# EAGLE design debug01 (EAGLE 6.4)
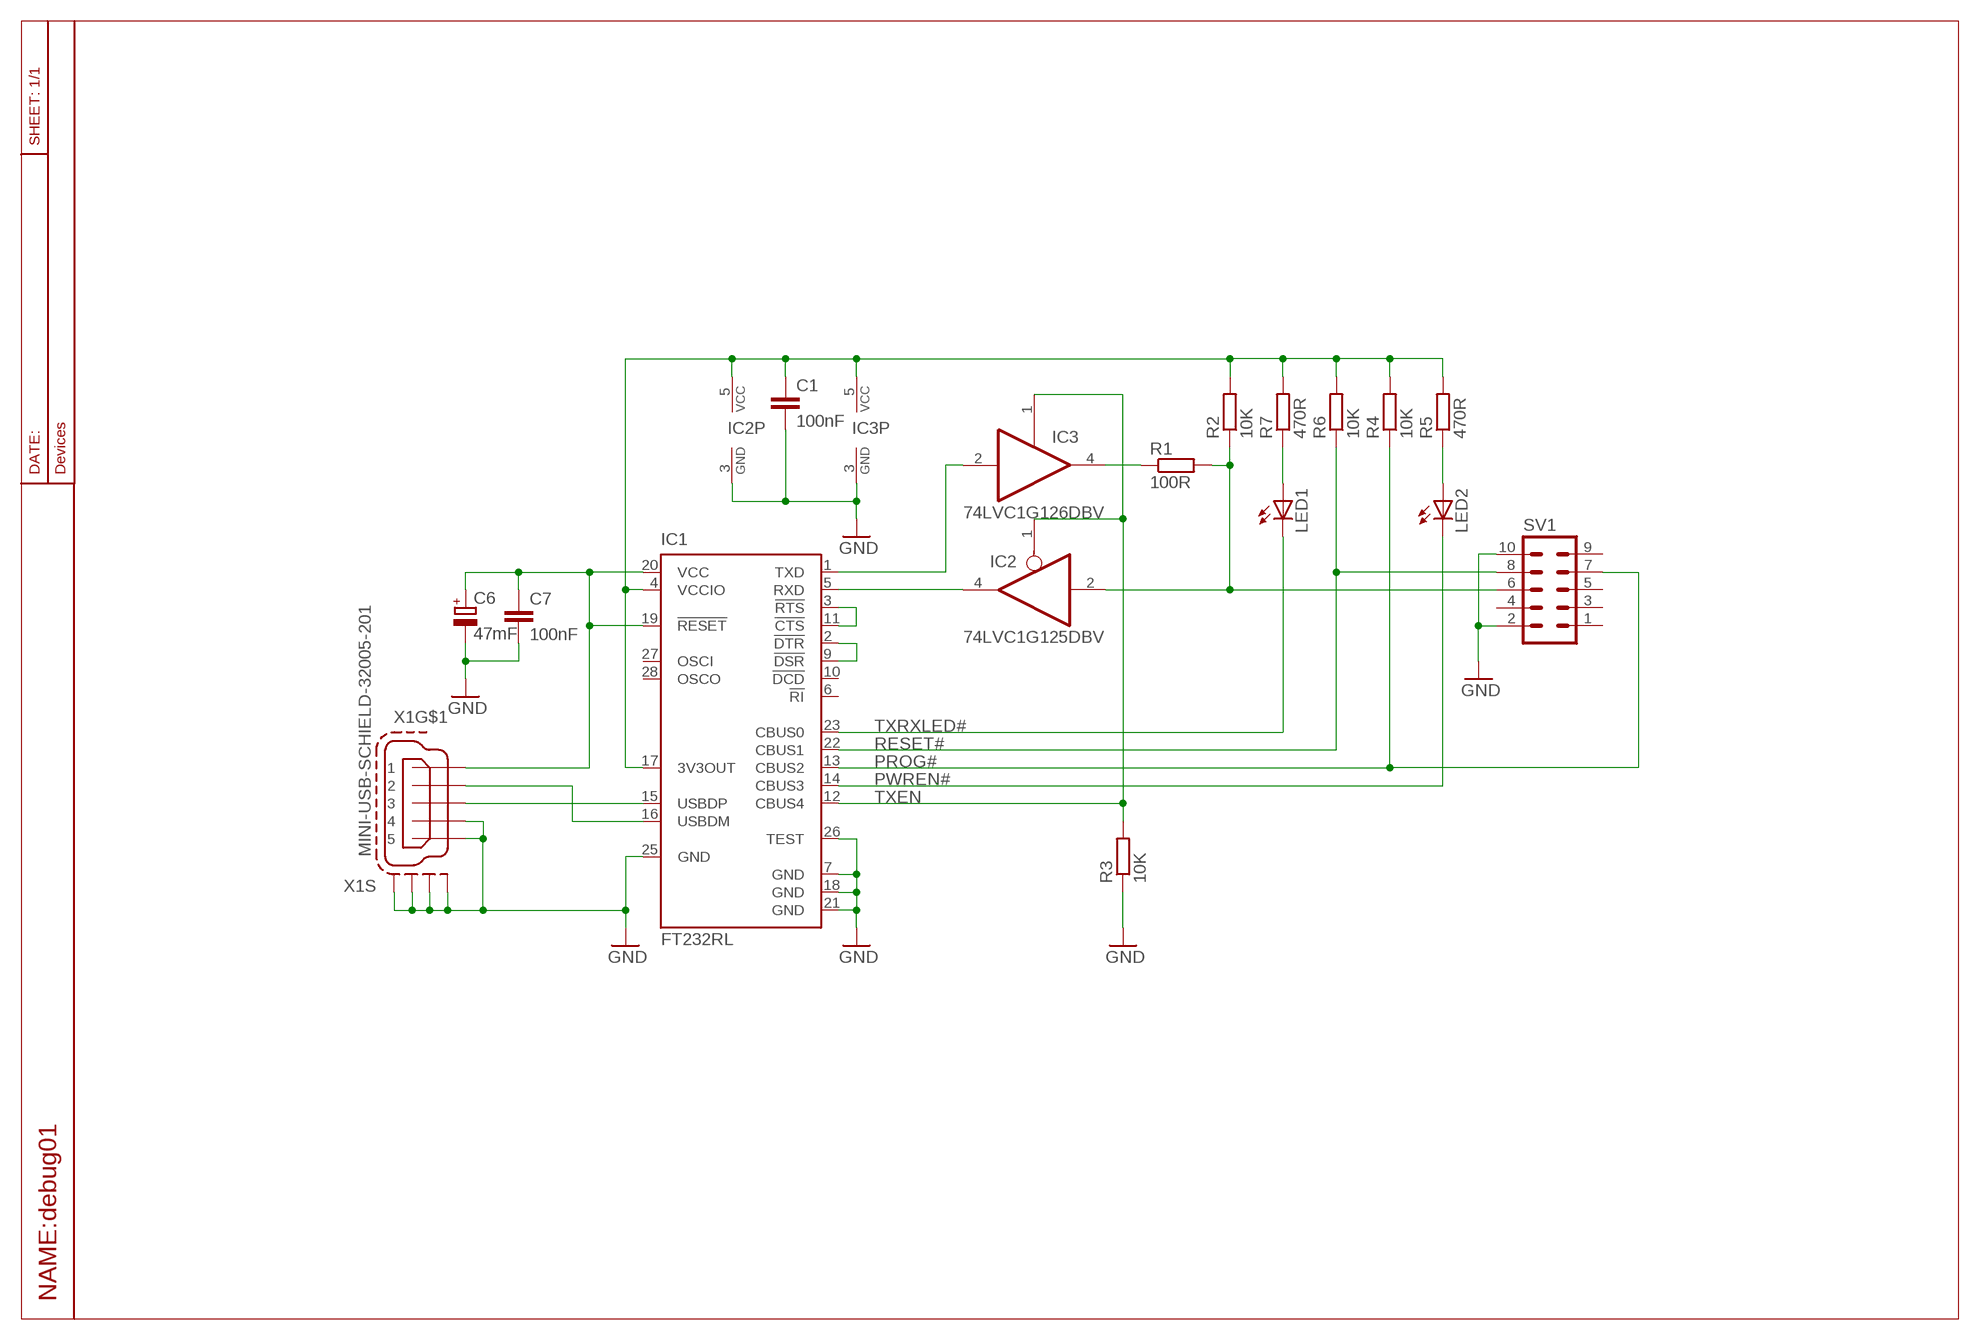
[diagram p0: schematic, sheet 1]

## Parts
C1  100nF  C-EUC0603  [C0603]
C6  47mF  CPOL-EUCT3528  [CT3528]
C7  100nF  C-EUC0603  [C0603]
IC1  FT232RL  [SSOP28]
IC2  74LVC1G125DBV  [SOT23-5]
IC3  74LVC1G126DBV  [SOT23-5]
LED1  LEDCHIPLED_0805  [CHIPLED_0805]
LED2  LEDCHIPLED_0805  [CHIPLED_0805]
R1  100R  R-EU_R0603  [R0603]
R2  10K  R-EU_R0603  [R0603]
R3  10K  R-EU_R1206  [R1206]
R4  10K  R-EU_R0603  [R0603]
R5  470R  R-EU_R0603  [R0603]
R6  10K  R-EU_R0603  [R0603]
R7  470R  R-EU_R0603  [R0603]
SV1  ML10  [ML10]
X1  MINI-USB-SCHIELD-32005-201  [32005-201]

## Nets
+3V3: C1.1 IC1.4(VCCIO) IC1.17(3V3OUT) IC2.5(VCC) IC3.5(VCC) R2.2 R4.2 R5.2 R6.2 R7.2
+5V0: C6.+ C7.1 IC1.19(!RESET) IC1.20(VCC) X1.1
DBG: IC2.2(I) R1.2 R2.1 SV1.6
DM: IC1.16(USBDM) X1.2
DP: IC1.15(USBDP) X1.3
GND: C1.2 C6.- C7.2 IC1.7(GND) IC1.18(GND) IC1.21(GND) IC1.25(GND) IC1.26(TEST) IC2.3(GND) IC3.3(GND) R3.1 SV1.2 SV1.10 X1.4 X1.5 X1.M1(S:S1) X1.M2(S:S2) X1.M3(S:S3) X1.M4(S:S4)
N$2: LED2.A R5.1
N$5: IC3.4(O) R1.1
N$7: LED1.A R7.1
N$10: IC1.2(!DTR) IC1.9(!DSR)
N$11: IC1.3(!RTS) IC1.11(!CTS)
PROG#: IC1.13(CBUS2) R4.1 SV1.7
PWREN#: IC1.14(CBUS3) LED2.C
RESET#: IC1.22(CBUS1) R6.1 SV1.8
RXD: IC1.5(RXD) IC2.4(O)
TXD: IC1.1(TXD) IC3.2(I)
TXEN: IC1.12(CBUS4) IC2.1(OE) IC3.1(OE) R3.2
TXRXLED#: IC1.23(CBUS0) LED1.C
Unconnected: IC1.6(!RI) IC1.10(!DCD) IC1.27(OSCI) IC1.28(OSCO) SV1.1 SV1.3 SV1.4 SV1.5 SV1.9

## Library data of the parts
C1 C7 = rcl:C-EU: CAPACITOR, European symbol
C6 = rcl:CPOL-EU: POLARIZED CAPACITOR, European symbol
IC1 = ftdichip:FT232R: Source: http://www.ftdichip.com/Documents/DataSheets/DS_FT232R_v104.pdf; MPN: FT232RL; OC_FARNELL: 1146032; OC_NEWARK: 91K9918
IC2 = 74xx-little-us:74*1G125: Single Bus Buffer Gate with 3-State Output
IC3 = 74xx-little-us:74*1G126: Single Bus Buffer Gate With 3-State Outputs
LED1 LED2 = led:LED: LED OSRAM: - CHIPLED LG R971, LG N971, LY N971, LG Q971, LY Q971, LO R971, LY R971 LH N974, LH R974 LS Q976, LO Q976, LY Q976 LO Q996 - Hyper CHIPLED LW Q18S LB Q993, LB Q99A, LB R99A - SideLED LS A670, LO A670, LY A670, LG A670, LP A670 LB A673, LV A673, LT A673, LW A673 LH A674 LY A675 LS A676, LA A676, LO A676, LY A676, LW A676 LS A679, LY A679, LG A679 - Hyper Micro SIDELED® LS Y876, LA Y876, LO Y876, LY Y876 LT Y87S - SmartLED LW L88C, LW L88S LB L89C, LB L89S, LG L890 LS L89K, LO L89K, LY L89K LS L896, LA L896, LO L896, LY L896 - TOPLED LS T670, LO T670, LY T670, LG T670, LP T670 LSG T670, LSP T670, LSY T670, LOP T670, LYG T670 LG T671, LOG T671, LSG T671 LB T673, LV T673, LT T673, LW T673 LH T674 LS T676, LA T676, LO T676, LY T676, LB T676, LH T676, LSB T676, LW T676 LB T67C, LV T67C, LT T67C, LS T67K, LO T67K, LY T67K, LW E67C LS E67B, LA E67B, LO E67B, LY E67B, LB E67C, LV E67C, LT E67C LW T67C LS T679, LY T679, LG T679 LS T770, LO T770, LY T770, LG T770, LP T770 LB T773, LV T773, LT T773, LW T773 LH T774 LS E675, LA E675, LY E675, LS T675 LS T776, LA T776, LO T776, LY T776, LB T776 LHGB T686 LT T68C, LB T68C - Hyper Mini TOPLED® LB M676 - Mini TOPLED Santana® LG M470 LS M47K, LO M47K, LY M47K Source: http://www.osram.convergy.de LUXEON: - LUMILED® LXK2-PW12-R00, LXK2-PW12-S00, LXK2-PW14-U00, LXK2-PW14-V00 LXK2-PM12-R00, LXK2-PM12-S00, LXK2-PM14-U00 LXK2-PE12-Q00, LXK2-PE12-R00, LXK2-PE12-S00, LXK2-PE14-T00, LXK2-PE14-U00 LXK2-PB12-K00, LXK2-PB12-L00, LXK2-PB12-M00, LXK2-PB14-N00, LXK2-PB14-P00, LXK2-PB14-Q00 LXK2-PR12-L00, LXK2-PR12-M00, LXK2-PR14-Q00, LXK2-PR14-R00 LXK2-PD12-Q00, LXK2-PD12-R00, LXK2-PD12-S00 LXK2-PH12-R00, LXK2-PH12-S00 LXK2-PL12-P00, LXK2-PL12-Q00, LXK2-PL12-R00 Source: www.luxeon.com KINGBRIGHT: KA-3528ASYC Source: www.kingbright.com
R1-R7 = rcl:R-EU_: RESISTOR, European symbol
SV1 = con-ml:ML10: HARTING; OC_FARNELL: unknown; OC_NEWARK: unknown
X1 = con-cypressindustries:MINI-USB-SCHIELD-: MINI USB-B Conector Source: www.cypressindustries.com; OC_FARNELL: unknown; OC_NEWARK: unknown

## Board
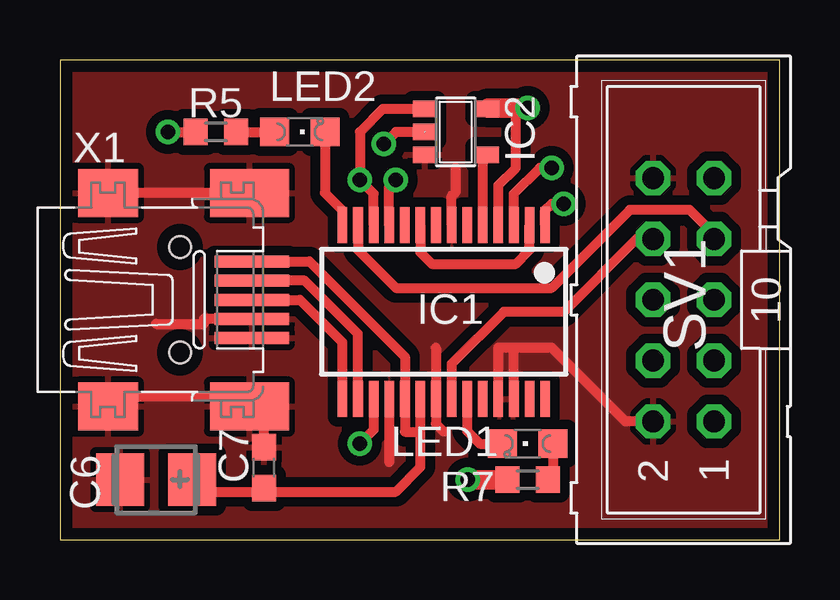
[diagram p1: board, top side]
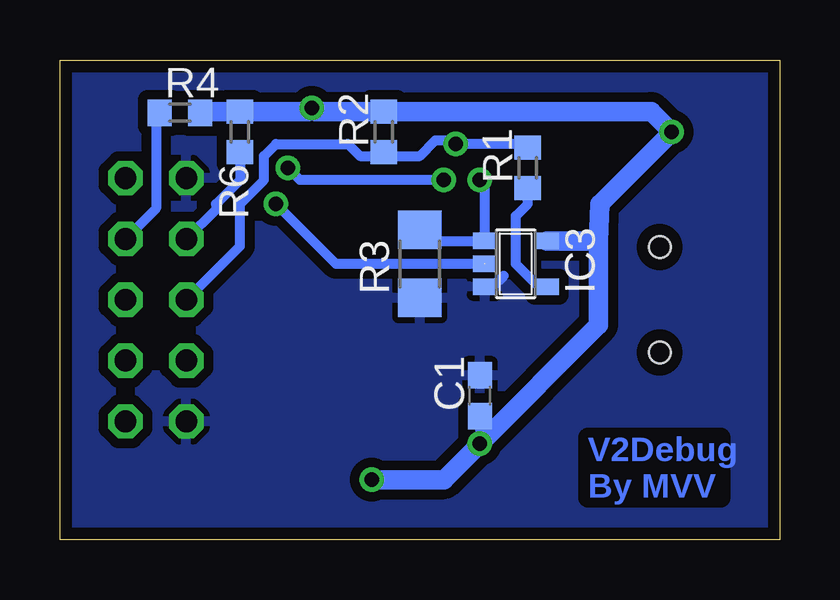
[diagram p2: board, bottom side, seen from below]

Size 30 x 20 mm. Coordinates in mm from the lower left corner, seen from the top.
Outline: 0,0 30,0 30,20 0,20 0,0
Copper layers (1*16): Top 0.035mm / dielectric 1.5mm / Bottom 0.035mm
Design rules "default *": minimum track width 10mil, minimum drill 24mil, track to track 8mil, track to pad 8mil, pad to pad 8mil, via to via 8mil, smd to smd 8mil, copper to edge 0.5mm, drill to drill 8mil, minimum pad ring 10mil, minimum via ring 8mil, stop-mask expansion 4mil, vias tented up to drill 0mil, thermal gap 10mil

### Footprints (pad centres in the part's own frame; a part is rotated, then mirrored left to right if it is on the bottom)
C0603 = smd 1.1 x 1: 1 -0.85,0; 2 0.85,0
CT3528 = smd 2 x 2.2: + -1.5,0; - 1.5,0
SSOP28 = smd 0.4 x 1.5: 1 -4.225,-3.625; 2 -3.575,-3.625; 3 -2.925,-3.625; 4 -2.275,-3.625; 5 -1.625,-3.625; 6 -0.975,-3.625; 7 -0.325,-3.625; 8 0.325,-3.625; 9 0.975,-3.625; 10 1.625,-3.625; 11 2.275,-3.625; 12 2.925,-3.625; 13 3.575,-3.625; 14 4.225,-3.625; 15 4.225,3.625; 16 3.575,3.625; 17 2.925,3.625; 18 2.275,3.625; 19 1.625,3.625; 20 0.975,3.625; 21 0.325,3.625; 22 -0.325,3.625; 23 -0.975,3.625; 24 -1.625,3.625; 25 -2.275,3.625; 26 -2.925,3.625; 27 -3.575,3.625; 28 -4.225,3.625
SOT23-5 = smd 0.69 x 0.99: 1 -0.95,-1.29; 2 0,-1.29; 3 0.95,-1.29; 4 0.95,1.3; 5 -0.95,1.3
CHIPLED_0805 = smd 1.2 x 1.2: A 0,-1.05; C 0,1.05
R0603 = smd 1 x 1.1: 1 -0.85,0; 2 0.85,0
R1206 = smd 1.6 x 1.803: 1 -1.422,0; 2 1.422,0
ML10 = drill 0.914 octagon: 1 -5.08,-1.27; 2 -5.08,1.27; 3 -2.54,-1.27; 4 -2.54,1.27; 5 0,-1.27; 6 0,1.27; 7 2.54,-1.27; 8 2.54,1.27; 9 5.08,-1.27; 10 5.08,1.27
32005-201 = smd 3.1 x 0.5: 1 3,1.6; 2 3,0.8; 3 3,0; 4 3,-0.8; 5 3,-1.6 | smd 2.5 x 2: M1 -3,-4.45; M2 -3,4.45 | smd 3.3 x 2: M3 2.9,4.45; M4 2.9,-4.45 | hole 0.9: 0,2.2; 0,-2.2

### Placement (x,y rotation side)
C1  12.5,6 90 bottom
C6  4,2.5 180 top
C7  8.5,3 90 top
IC1  16,9.5 180 top
IC2  16.5,17 270 top
IC3  11,11.5 270 bottom
LED1  19.5,4 90 top
LED2  10,17 270 top
R1  10.5,15.5 90 bottom
R2  16.5,17 90 bottom
R3  15,11.5 90 bottom
R4  25,17.8 0 bottom
R5  6.5,17 180 top
R6  22.5,17 90 bottom
R7  19.5,2.5 180 top
SV1  26,10 90 top
X1  5,10 0 top

### Tracks (layer width: path | path; a pad name or v marks a point on that pad's centre or on a via)
+3V3  (via drill 0.6)
  Top 0.406: IC1.4 18.27,14.78 19,15.5 19,18 | 17.85,18 IC2.5 | IC1.17 13.07,4.58 v12.5,4 | v4.5,17 R5.2
  Top 0.813: 17.85,18 19,18 v19.5,18 | R7.2 v17,2.5
  Bottom 0.406: 19.15,17.85 v19.5,18 19.35,17.85 | 24.15,17.85 R4.2 | C1.1 v12.5,4
  Bottom 0.813: 7.55,12.45 7.55,8.95 v12.5,4 14,2.5 v17,2.5 | IC3.5 7.55,12.45 | v19.5,18 19.65,17.85 R6.2 24.15,17.85 | 7.55,12.45 7.5,14 v4.5,17 5.35,17.85 R2.2 19.35,17.85
+5V0
  Top 0.406: 15.03,4.5 15.03,3.02 14,2 8.65,2 C7.1 8.35,2 6,2 C6.+ | 15.03,4.5 IC1.20 | 15.03,4.5 14.38,4.5 IC1.19 14.38,7.62 10.4,11.6 X1.1
DBG  (via drill 0.6)
  Top 0.406: IC2.2 14,17 v13.5,16.5
  Bottom 0.406: SV1.6 22.5,12.23 22.5,14 21.5,15 21.5,16 21,16.5 18,16.5 17.5,16 16.65,16 R2.1 16.5,16 15,16 14.35,16.65 13.65,16.65 v13.5,16.5 10.5,16.5 R1.2
DM
  Top 0.406: IC1.16 12.43,8.57 10.2,10.8 X1.2
DP
  Top 0.406: X1.3 10,10 11.78,8.22 IC1.15
GND
  Top 0.406: IC1.7 16.32,14.32 16.5,14.5 16.5,15.5 | IC1.18 13.72,3.23 | IC1.26 18.93,8 | 18.93,8 18.27,8 IC1.25 | SV1.2 23.58,4.92 20.5,8 18.93,8 | X1.M3 8.05,14.45 | X1.4 6,9.2 6,9 4,9 | X1.M4 7.47,5.97 2.42,5.97 X1.M1 | X1.M3 X1.M2 | 8.55,14.45 X1.M3 | C7.2 8.5,5 8,5.5 | 15.68,8 IC1.21 15.68,4.83 16,4.5
  Bottom 0.406: IC3.3 11.95,10.55 11.5,11
  pour Top (isolate 0.406): 0,20 30,20 30,0 0,0
  pour Bottom (isolate 0.406): 0,20 0,0 30,0 30,20
N$2
  Top 0.406: R5.1 LED2.A
N$5
  Bottom 0.406: IC3.4 10.05,10.55 11,11.5 11,13.5 10.5,14 R1.1
N$7
  Top 0.406: LED1.A 20.55,2.7 R7.1
N$10
  Top 0.406: IC1.9 15.03,11.97 15.5,11.5 19,11.5 19.57,12.07 IC1.2
N$11  (via drill 0.6)
  Top 0.406: IC1.11 13.72,14.72 v14,15 | IC1.3 18.93,14.43 20,15.5 v20.5,15.5
  Bottom 0.406: v14,15 20,15 v20.5,15.5
PROG#
  Top 0.406: IC1.13 12.43,12.07 14,10.5 20.5,10.5 23.75,13.75 26.25,13.75 27.27,12.73 SV1.7
  Bottom 0.406: R4.1 26,17.5 26,13.81 SV1.7
PWREN#
  Top 0.406: IC1.14 11.78,13.72 11.05,14.45 LED2.C
RESET#
  Top 0.406: SV1.8 24.04,12.54 21,9.5 18.5,9.5 16.32,7.33 IC1.22
  Bottom 0.406: R6.1 22.5,15 23.5,14 23.5,13.77 SV1.8
RXD
  Top 0.406: IC1.5 17.62,15.88 IC2.4
TXD  (via drill 0.6)
  Top 0.406: IC1.1 20.23,13.72 20.5,14 v21,14
  Bottom 0.406: IC3.2 18.5,11.5 v21,14
TXEN  (via drill 0.6)
  Top 0.406: IC2.1 13.45,17.95 12.5,17 v12.5,15 13.07,14.43 IC1.12
  Bottom 0.406: v12.5,15 12.29,14.79 IC3.1 14.53,12.45 R3.2
TXRXLED#
  Top 0.406: IC1.23 16.98,4.53 17.5,4 LED1.C

### Text on the board
Bottom: V2Debug / By MVV